# Altium schematic sheet Sheet2.SchDoc
size A; CompanyName: RUDRA
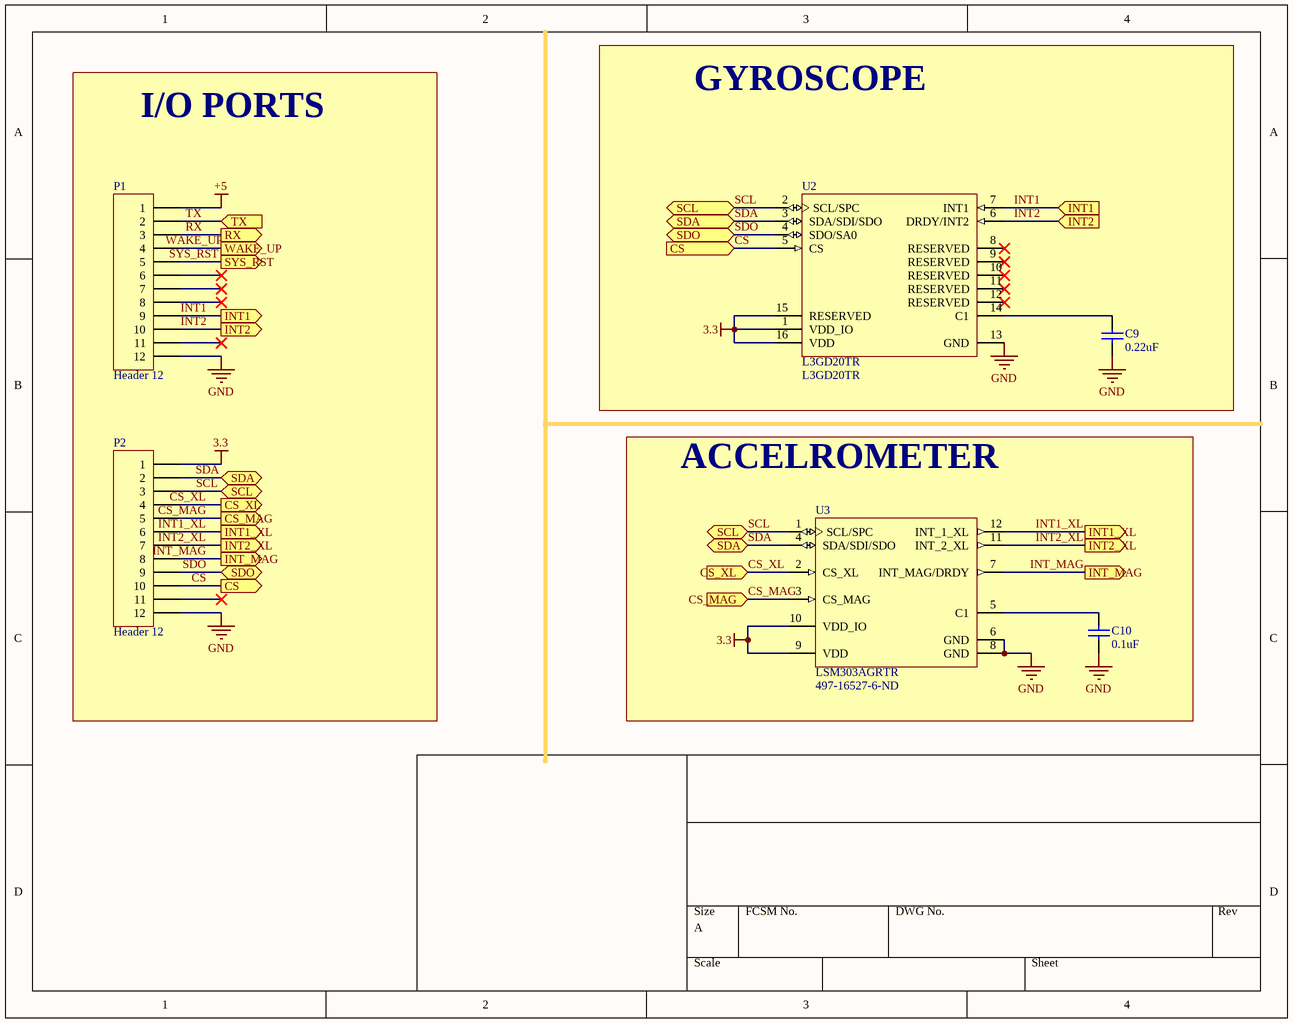
[diagram p0: Sheet2.SchDoc]

## Parts
C9  0.22uF  [CAPC2013X140X50ML20T25]
C10  0.1uF  [CAPC2013X135X45LL10T25]
P1  Header 12  [HDR1X12]
P2  Header 12  [HDR1X12]
U2  L3GD20TR  [STM-LGA16-4X4X1.1]
U3  LSM303AGRTR  Supplier Part Number 1: 497-16527-6-ND  [STM-LGA-12]

## Blocks framed on the sheet
I/O PORTS: P1 P2
GYROSCOPE: C9 U2
ACCELROMETER: C10 U3

## Ports
CS (in), CS (out), CS_MAG (in), CS_MAG (out), CS_XL (in), CS_XL (out), INT1 (in), INT1 (out), INT1_XL (out), INT2 (in), INT2 (out), INT2_XL (out), INT_MAG  (out), INT_MAG (out), RX (out), SCL (bidir), SDA (bidir), SDO (bidir), SYS_RST (out), TX (in), WAKE_UP (out)

## Nets
3.3: P2.1 U2.1(VDD_IO) U2.15(RESERVED) U2.16(VDD) U3.9(VDD) U3.10(VDD_IO)
+5: P1.1
GND: C9.1 C10.1 P1.12 P2.12 U2.13(GND) U3.6(GND) U3.8(GND)
CS: P2.10 U2.5(CS) ; port CS  [also labelled CS ]
CS_MAG: P2.5 U3.3(CS_MAG) ; port CS_MAG
CS_XL: P2.4 U3.2(CS_XL) ; port CS_XL
INT1: P1.9 U2.7(INT1) ; port INT1  [also labelled INT1 ]
INT1_XL: P2.6 U3.12(INT_1_XL) ; port INT1_XL
INT2: P1.10 U2.6(DRDY/INT2) ; port INT2  [also labelled INT2 ]
INT2_XL: P2.7 U3.11(INT_2_XL) ; port INT2_XL
INT_MAG: P2.8 U3.7(INT_MAG/DRDY) ; port INT_MAG , port INT_MAG
RX: P1.3 ; port RX
SCL: P2.3 U2.2(SCL/SPC) U3.1(SCL/SPC) ; port SCL
SDA: P2.2 U2.3(SDA/SDI/SDO) U3.4(SDA/SDI/SDO) ; port SDA
SDO: P2.9 U2.4(SDO/SA0) ; port SDO
SYS_RST: P1.5 ; port SYS_RST
TX: P1.2 ; port TX
WAKE_UP: P1.4 ; port WAKE_UP
NetC9_2: C9.2 U2.14(C1)
NetC10_2: C10.2 U3.5(C1)

Not connected (* = marked no-connect by the designer): P1 6* 7* 8* 11*; P2 11*; U2 8(RESERVED)* 9(RESERVED)* 10(RESERVED)* 11(RESERVED)* 12(RESERVED)*

## Library data of the parts
C9 = CAP SMD 0.22uF 0805: CAP CER 0.22UF 25V X7R 0805; Manufacturer: AVX Interconnect / Elco; Part Number: 08053C224JAT2A; Manufacturer 1: Kyocera AVX; Dielectric Material: Ceramic; Capacitance: 220nF; Tolerance: 5%; Supplier 1: Digi-Key; Manufacturer Part Number 1: 08053C224JAT2A; Stock 1: 18745; Pricing 1: 1=0.28000, 10=0.19000, 100=0.09610, 500=0.06578, 1000=0.05819 (USD); RoHS: Yes; Mount: Surface Mount,PCB; Case/Package: 0805; Number of Pins: 2; Case Code (Imperial): 0805; Case Code (Metric): 2012; Contact Plating: Tin,Matte; Min Operating Temperature: -55°C; Max Operating Temperature: 125°C; Packaging: Tape and Reel; Voltage Rating (DC): 25V; Dielectric: X7R; Voltage Rating: 25V; Package Quantity: 1; Termination: SMD/SMT; Voltage: 25V; Length: 2.01mm; Height: 1.4mm; Depth: 1.25mm; Width: 1.25mm; Thickness: 0.055inch; Radiation Hardening: No; REACH SVHC: No SVHC; Lead Free: Lead Free; ComponentLink1URL: https://datasheet.ciiva.com/5417/cx7r-218113-5417493.pdf?src-supplier=Mouser; ComponentLink1Description: https://datasheet.ciiva.com/5417/cx7r-218113-5417493.pdf?src-supplier=Mouser; ComponentLink2URL: https://datasheet.ciiva.com/16326/cx7r-16326599.pdf?src-supplier=Future+Electronics; ComponentLink2Description: https://datasheet.ciiva.com/16326/cx7r-16326599.pdf?src-supplier=Future+Electronics; ComponentLink3URL: https://datasheet.ciiva.com/162/cx7r-162344.pdf?src-supplier=Digi-Key; ComponentLink3Description: https://datasheet.ciiva.com/162/cx7r-162344.pdf?src-supplier=Digi-Key; ComponentLink4URL: https://datasheet.ciiva.com/162/cx7r-162345.pdf?src-supplier=Digi-Key; ComponentLink4Description: https://datasheet.ciiva.com/162/cx7r-162345.pdf?src-supplier=Digi-Key; ComponentLink5URL: https://datasheet.ciiva.com/162/cx7r-162346.pdf?src-supplier=Digi-Key; ComponentLink5Description: https://datasheet.ciiva.com/162/cx7r-162346.pdf?src-supplier=Digi-Key; ComponentLink6URL: https://datasheet.ciiva.com/17494/cx7r-17494874.pdf?src-supplier=Avnet+Europe; ComponentLink6Description: https://datasheet.ciiva.com/17494/cx7r-17494874.pdf?src-supplier=Avnet+Europe; ComponentLink7URL: https://datasheet.ciiva.com/14594/70001075-14594669.pdf?src-supplier=Allied+Electronics; ComponentLink7Description: https://datasheet.ciiva.com/14594/70001075-14594669.pdf?src-supplier=Allied+Electronics; ComponentLink8URL: https://datasheet.ciiva.com/7811/cx7r-7811999.pdf?src-supplier=Element14; ComponentLink8Description: https://datasheet.ciiva.com/7811/cx7r-7811999.pdf?src-supplier=Element14; Supplier Part Number 1: 478-3756-1-ND
C10 = CAP SMD 0.1uF 0805: Chip Capacitor, 0.1 uF, +/- 10%, 50 V, -55 to 125 degC, 0805 (2012 Metric), RoHS, Tape and Reel; Manufacturer: Murata; Manufacturer Part Number 1: GRM21BR71H104KA01L; Voltage: 50V; Capacitance: 100nF; Insulation Resistance: 10GR; Dielectric Material: Ceramic; Dielectric: X7R; Package Description: 2-Pin Surface Mount Device, Body 2 x 1.25 mm; Manufacturer URL: http://www.murata.com/; Case Code (Imperial): 0805; Datasheet URL: http://psearch.en.murata.com/capacitor/product/GRM21BR71H104KA01%23.pdf; Termination: SMD/SMT; Lead Free: LeadFree; Package Quantity: 1; Mount: SurfaceMount; REACH SVHC: Unknown; Thickness: 0.053inch; Height: 1.25mm; Case/Package: 0805; Voltage Rating: 50V; Width: 0.049inch; Case Code (Metric): 2012; Material: Ceramic; Min Operating Temperature: -55degC; RoHSCompliant: true; Datasheet Version: 42675.0; Voltage Rating (DC): 50V; Tolerance: 10%; Package Reference: 0805; Depth: 1.25mm; Length: 2mm; Max Operating Temperature: 125degC; Packaging: TapeandReel; Number of Pins: 2; Radiation Hardening: No; Supplier 1: Future Electronics; Manufacturer 1: Murata; Stock 1: 7476000; Pricing 1: 3000=0.01700 (USD); RoHS: Yes; ComponentLink1URL: https://datasheet.ciiva.com/11786/0900766b8003061f-11786305.pdf?src-supplier=RSComponents; ComponentLink1Description: https://datasheet.ciiva.com/11786/0900766b8003061f-11786305.pdf?src-supplier=RSComponents; ComponentLink2URL: https://datasheet.ciiva.com/20173/71-2024-20173169.pdf?src-supplier=Rapid+Electronics; ComponentLink2Description: https://datasheet.ciiva.com/20173/71-2024-20173169.pdf?src-supplier=Rapid+Electronics; ComponentLink3URL: https://datasheet.ciiva.com/29200/453120-da-01-en-vs-kondensator-0805-29200537.pdf?src-supplier=Conrad; ComponentLink3Description: https://datasheet.ciiva.com/29200/453120-da-01-en-vs-kondensator-0805-29200537.pdf?src-supplier=Conrad; ComponentLink4URL: https://datasheet.ciiva.com/132/partnumbering-e-01-132209.pdf?src-supplier=Digi-Key; ComponentLink4Description: https://datasheet.ciiva.com/132/partnumbering-e-01-132209.pdf?src-supplier=Digi-Key; ComponentLink5URL: https://datasheet.ciiva.com/132/partnumbering-e-01-132210.pdf?src-supplier=Digi-Key; ComponentLink5Description: https://datasheet.ciiva.com/132/partnumbering-e-01-132210.pdf?src-supplier=Digi-Key; ComponentLink6URL: https://datasheet.ciiva.com/132/partnumbering-e-01-132211.pdf?src-supplier=Digi-Key; ComponentLink6Description: https://datasheet.ciiva.com/132/partnumbering-e-01-132211.pdf?src-supplier=Digi-Key; ComponentLink7URL: https://datasheet.ciiva.com/7937/1794405-7937708.pdf?src-supplier=Element14; ComponentLink7Description: https://datasheet.ciiva.com/7937/1794405-7937708.pdf?src-supplier=Element14; ComponentLink8URL: https://datasheet.ciiva.com/7937/1794405-7937709.pdf?src-supplier=Element14; ComponentLink8Description: https://datasheet.ciiva.com/7937/1794405-7937709.pdf?src-supplier=Element14; ComponentLink9URL: https://datasheet.ciiva.com/28534/1769893-28534317.pdf?src-supplier=Element14; ComponentLink9Description: https://datasheet.ciiva.com/28534/1769893-28534317.pdf?src-supplier=Element14; ComponentLink10URL: https://datasheet.ciiva.com/7937/4360-7937710.pdf?src-supplier=Element14; ComponentLink10Description: https://datasheet.ciiva.com/7937/4360-7937710.pdf?src-supplier=Element14; Supplier Part Number 1: GRM21BR71H104KA01L-REEL
P1 P2 = Header 12: Header, 12-Pin; LatestRevisionDate: 17-Jul-2002; LatestRevisionNote: Re-released for DXP Platform.; Publisher: Altium Limited
U2 = GYROSCOPE: MEMS Motion Sensor: Three-Axis Digital Output Gyroscope, 2.4 to 3.6 V, -40 to 85 degC, 16-Pin LGA, RoHS, Tape and Reel; Manufacturer: STMicroelectronics; Supply Current: 6.1 mA; SoDr: +/- 2%; Supply Current In Sleep Mode: 2 mA; Full Scales: 250, 500, 2000 dps; Max Supply Voltage: 3.6V; Min Supply Voltage: 2.4V; Nominal Supply Current: 6.1mA; Output Type: SPI,I2C,Digital; Linearity: 0.2%; Interface: I2C,SPI; DatasheetVersion: Rev. 2; PartNumber: L3GD20TR; ComponentLink2URL: http://www.st.com/web/en/resource/technical/document/datasheet/DM00036465.pdf; RoHS: TRUE; Temperature Range: -40 to 85 degC; PackageReference: LGA16-4X4X1.1; PackageDescription: 16-Pin Land Grid Array Package, Body 4 x 4 mm, Pitch 0.65 mm; ComponentLink2Description: Datasheet; ComponentLink1Description: Manufacturer URL; Supply Voltage: 2.4 to 3.6 V; Packing: Tape and Reel; PackageVersion: Rev. 2; ComponentLink1URL: http://www.st.com/; Mounting Technology: Surface Mount; ComponentLink3URL: http://www.st.com/web/en/resource/technical/document/datasheet/DM00036465.pdf; ComponentLink3Description: Package Specification; Supplier 1: Avnet; Manufacturer 1: STMicroelectronics; Manufacturer Part Number 1: L3GD20TR; Stock 1: 0; Case/Package: LGA; Number of Pins: 16; Min Operating Temperature: -40°C; Max Operating Temperature: 85°C; Package Quantity: 3000; Packaging: Tape and Reel; Operating Supply Voltage: 3.6V; Operating Supply Current: 6.1mA; Length: 4mm; Height: 1mm; Width: 4mm; Lead Free: Lead Free; REACH SVHC: No SVHC; ComponentLink4URL: https://datasheet.ciiva.com/2815/dm00036465-2815728.pdf?src-supplier=Digi-Key; ComponentLink4Description: https://datasheet.ciiva.com/2815/dm00036465-2815728.pdf?src-supplier=Digi-Key; ComponentLink5URL: https://datasheet.ciiva.com/2815/dm00036465-2815729.pdf?src-supplier=Digi-Key; ComponentLink5Description: https://datasheet.ciiva.com/2815/dm00036465-2815729.pdf?src-supplier=Digi-Key; ComponentLink6URL: https://datasheet.ciiva.com/12092/dm00036465-12092269.pdf?src-supplier=Mouser; ComponentLink6Description: https://datasheet.ciiva.com/12092/dm00036465-12092269.pdf?src-supplier=Mouser; ComponentLink7URL: https://datasheet.ciiva.com/2815/dm00036465-2815727.pdf?src-supplier=Digi-Key; ComponentLink7Description: https://datasheet.ciiva.com/2815/dm00036465-2815727.pdf?src-supplier=Digi-Key; Supplier Part Number 1: L3GD20TR
U3 = E-COMPASS: Ultra-Compact High-Performance Ecompass Module: Ultra-Low-Power 3D Accelerometer and 3D Magnetometer, 1.71 to 3.6 V, -40 to 85 degC, 12-Pin LGA, RoHS, Tape and Reel; Manufacturer: STMicroelectronics; Min Supply Voltage: 1.71V; Max Supply Voltage: 3.6V; Sensor Type: Accelerometer,Magnetometer,3 Axis; Output Type: SPI,I2C; Manufacturer URL: http://www.st.com/; Package Description: 12-Pin Land Grid Array Package, Body 2 x 2 mm, Pitch 0.5 mm; Mounting Technology: SurfaceMount; Packaging: CutTape; Datasheet URL: http://www.st.com/content/ccc/resource/technical/document/datasheet/74/c4/19/54/62/c5/46/13/DM00177685.pdf/files/DM00177685.pdf/jcr:content/translations/en.DM00177685.pdf; RoHSCompliant: true; Number of Pins: 12; Package Reference: LGA-12; Min Operating Temperature: -40degC; REACH SVHC: NoSVHC; Case\/Package: LGA; Max Operating Temperature: 85degC; Datasheet Version: Rev. 9, 09/2016; Supplier 1: Digi-Key; Manufacturer 1: STMicroelectronics; Manufacturer Part Number 1: LSM303AGRTR; Stock 1: 7477; Pricing 1: 1=2.92000, 10=2.61800, 25=2.47520, 100=2.14500, 500=1.82600, 1000=1.54000 (USD); RoHS: Yes; Case/Package: LGA; ComponentLink1URL: https://www.mouser.com/ds/2/389/lsm303agr-954987.pdf?src-supplier=Mouser; ComponentLink1Description: https://www.mouser.com/ds/2/389/lsm303agr-954987.pdf?src-supplier=Mouser; ComponentLink2URL: http://www.farnell.com/datasheets/2151221.pdf?src-supplier=Farnell; ComponentLink2Description: http://www.farnell.com/datasheets/2151221.pdf?src-supplier=Farnell; ComponentLink3URL: http://www.farnell.com/datasheets/2151221.pdf?src-supplier=Element14; ComponentLink3Description: http://www.farnell.com/datasheets/2151221.pdf?src-supplier=Element14; ComponentLink4URL: http://www.st.com/content/ccc/resource/technical/document/datasheet/74/c4/19/54/62/c5/46/13/DM00177685.pdf/files/DM00177685.pdf/jcr:content/translations/en.DM00177685.pdf?src-supplier=Digi-Key; ComponentLink4Description: http://www.st.com/content/ccc/resource/technical/document/datasheet/74/c4/19/54/62/c5/46/13/DM00177685.pdf/files/DM00177685.pdf/jcr:content/translations/en.DM00177685.pdf?src-supplier=Digi-Key